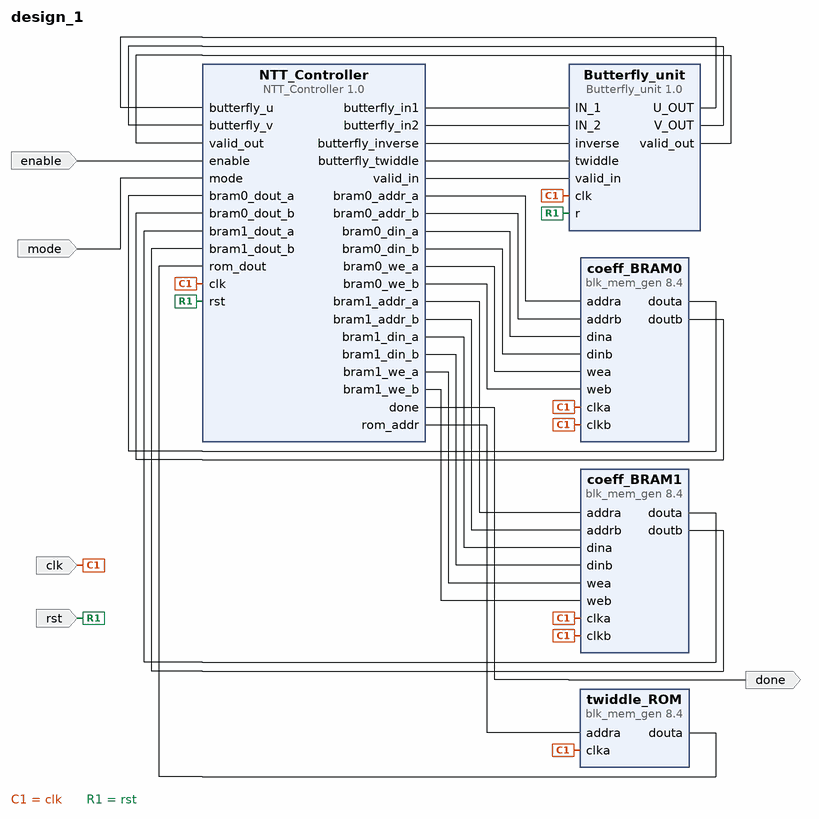
[diagram p0: block diagram of the top level]
# Vivado block design design_1, xc7z020clg400-1, Vivado 2021.2
create_bd_design design_1

create_bd_port -dir I -type clk clk
set_property -dict {CONFIG.ASSOCIATED_RESET rst} [get_bd_ports clk]
create_bd_port -dir I -type rst rst
create_bd_port -dir I enable
create_bd_port -dir I mode
create_bd_port -dir O done

create_bd_cell -type ip -vlnv xilinx.com:ip:blk_mem_gen:8.4 coeff_BRAM0
set_property -dict [list \
  CONFIG.Assume_Synchronous_Clk true \
  CONFIG.Coe_File ../../../../../../bram_input_coeffs.coe \
  CONFIG.Enable_32bit_Address false \
  CONFIG.Enable_A Always_Enabled \
  CONFIG.Enable_B Always_Enabled \
  CONFIG.Fill_Remaining_Memory_Locations true \
  CONFIG.Load_Init_File true \
  CONFIG.Memory_Type True_Dual_Port_RAM \
  CONFIG.Port_B_Clock 100 \
  CONFIG.Port_B_Enable_Rate 100 \
  CONFIG.Port_B_Write_Rate 50 \
  CONFIG.Read_Width_A 12 \
  CONFIG.Read_Width_B 12 \
  CONFIG.Register_PortA_Output_of_Memory_Primitives false \
  CONFIG.Register_PortB_Output_of_Memory_Primitives false \
  CONFIG.Use_Byte_Write_Enable false \
  CONFIG.Use_RSTA_Pin false \
  CONFIG.Write_Depth_A 256 \
  CONFIG.Write_Width_A 12 \
  CONFIG.Write_Width_B 12 \
  CONFIG.use_bram_block Stand_Alone \
] [get_bd_cells coeff_BRAM0]
create_bd_cell -type ip -vlnv xilinx.com:ip:blk_mem_gen:8.4 coeff_BRAM1
set_property -dict [list \
  CONFIG.Assume_Synchronous_Clk true \
  CONFIG.Coe_File ../../../../../../bram_input_coeffs.coe \
  CONFIG.Enable_32bit_Address false \
  CONFIG.Enable_A Always_Enabled \
  CONFIG.Enable_B Always_Enabled \
  CONFIG.Fill_Remaining_Memory_Locations true \
  CONFIG.Load_Init_File true \
  CONFIG.Memory_Type True_Dual_Port_RAM \
  CONFIG.Port_B_Clock 100 \
  CONFIG.Port_B_Enable_Rate 100 \
  CONFIG.Port_B_Write_Rate 50 \
  CONFIG.Read_Width_A 12 \
  CONFIG.Read_Width_B 12 \
  CONFIG.Register_PortA_Output_of_Memory_Primitives false \
  CONFIG.Register_PortB_Output_of_Memory_Primitives false \
  CONFIG.Use_Byte_Write_Enable false \
  CONFIG.Use_RSTA_Pin false \
  CONFIG.Write_Depth_A 256 \
  CONFIG.Write_Width_A 12 \
  CONFIG.Write_Width_B 12 \
  CONFIG.use_bram_block Stand_Alone \
] [get_bd_cells coeff_BRAM1]
create_bd_cell -type ip -vlnv xilinx.com:ip:blk_mem_gen:8.4 twiddle_ROM
set_property -dict [list \
  CONFIG.Coe_File ../../../../../../twiddle_factors.coe \
  CONFIG.Enable_32bit_Address false \
  CONFIG.Enable_A Always_Enabled \
  CONFIG.Fill_Remaining_Memory_Locations true \
  CONFIG.Load_Init_File true \
  CONFIG.Memory_Type Single_Port_ROM \
  CONFIG.Port_A_Write_Rate 0 \
  CONFIG.Register_PortA_Output_of_Memory_Primitives false \
  CONFIG.Use_RSTA_Pin false \
  CONFIG.Write_Depth_A 256 \
  CONFIG.Write_Width_A 12 \
  CONFIG.use_bram_block Stand_Alone \
] [get_bd_cells twiddle_ROM]
create_bd_cell -type ip -vlnv xilinx.com:user:Butterfly_unit:1.0 Butterfly_unit
create_bd_cell -type ip -vlnv xilinx.com:user:NTT_Controller:1.0 NTT_Controller

# ---- connections ----

connect_bd_net [get_bd_pins Butterfly_unit/U_OUT] [get_bd_pins NTT_Controller/butterfly_u]
connect_bd_net [get_bd_pins Butterfly_unit/V_OUT] [get_bd_pins NTT_Controller/butterfly_v]
connect_bd_net [get_bd_pins Butterfly_unit/valid_out] [get_bd_pins NTT_Controller/valid_out]
connect_bd_net [get_bd_pins NTT_Controller/bram0_addr_a] [get_bd_pins coeff_BRAM0/addra]
connect_bd_net [get_bd_pins NTT_Controller/bram0_addr_b] [get_bd_pins coeff_BRAM0/addrb]
connect_bd_net [get_bd_pins NTT_Controller/bram0_din_a] [get_bd_pins coeff_BRAM0/dina]
connect_bd_net [get_bd_pins NTT_Controller/bram0_din_b] [get_bd_pins coeff_BRAM0/dinb]
connect_bd_net [get_bd_pins NTT_Controller/bram0_we_a] [get_bd_pins coeff_BRAM0/wea]
connect_bd_net [get_bd_pins NTT_Controller/bram0_we_b] [get_bd_pins coeff_BRAM0/web]
connect_bd_net [get_bd_pins NTT_Controller/bram1_addr_a] [get_bd_pins coeff_BRAM1/addra]
connect_bd_net [get_bd_pins NTT_Controller/bram1_addr_b] [get_bd_pins coeff_BRAM1/addrb]
connect_bd_net [get_bd_pins NTT_Controller/bram1_din_a] [get_bd_pins coeff_BRAM1/dina]
connect_bd_net [get_bd_pins NTT_Controller/bram1_din_b] [get_bd_pins coeff_BRAM1/dinb]
connect_bd_net [get_bd_pins NTT_Controller/bram1_we_a] [get_bd_pins coeff_BRAM1/wea]
connect_bd_net [get_bd_pins NTT_Controller/bram1_we_b] [get_bd_pins coeff_BRAM1/web]
connect_bd_net [get_bd_pins NTT_Controller/butterfly_in1] [get_bd_pins Butterfly_unit/IN_1]
connect_bd_net [get_bd_pins NTT_Controller/butterfly_in2] [get_bd_pins Butterfly_unit/IN_2]
connect_bd_net [get_bd_pins NTT_Controller/butterfly_inverse] [get_bd_pins Butterfly_unit/inverse]
connect_bd_net [get_bd_pins NTT_Controller/butterfly_twiddle] [get_bd_pins Butterfly_unit/twiddle]
connect_bd_net [get_bd_pins NTT_Controller/done] [get_bd_ports done]
connect_bd_net [get_bd_pins NTT_Controller/rom_addr] [get_bd_pins twiddle_ROM/addra]
connect_bd_net [get_bd_pins NTT_Controller/valid_in] [get_bd_pins Butterfly_unit/valid_in]
connect_bd_net -net clk_0_1 [get_bd_ports clk] \
  [get_bd_pins twiddle_ROM/clka] [get_bd_pins coeff_BRAM0/clka] [get_bd_pins coeff_BRAM0/clkb] [get_bd_pins coeff_BRAM1/clka] \
  [get_bd_pins coeff_BRAM1/clkb] [get_bd_pins Butterfly_unit/clk] [get_bd_pins NTT_Controller/clk]
connect_bd_net [get_bd_pins coeff_BRAM0/douta] [get_bd_pins NTT_Controller/bram0_dout_a]
connect_bd_net [get_bd_pins coeff_BRAM0/doutb] [get_bd_pins NTT_Controller/bram0_dout_b]
connect_bd_net [get_bd_pins coeff_BRAM1/douta] [get_bd_pins NTT_Controller/bram1_dout_a]
connect_bd_net [get_bd_pins coeff_BRAM1/doutb] [get_bd_pins NTT_Controller/bram1_dout_b]
connect_bd_net -net enable_0_1 [get_bd_ports enable] [get_bd_pins NTT_Controller/enable]
connect_bd_net -net mode_0_1 [get_bd_ports mode] [get_bd_pins NTT_Controller/mode]
connect_bd_net -net rst_0_1 [get_bd_ports rst] [get_bd_pins Butterfly_unit/r] [get_bd_pins NTT_Controller/rst]
connect_bd_net [get_bd_pins twiddle_ROM/douta] [get_bd_pins NTT_Controller/rom_dout]

validate_bd_design
save_bd_design
